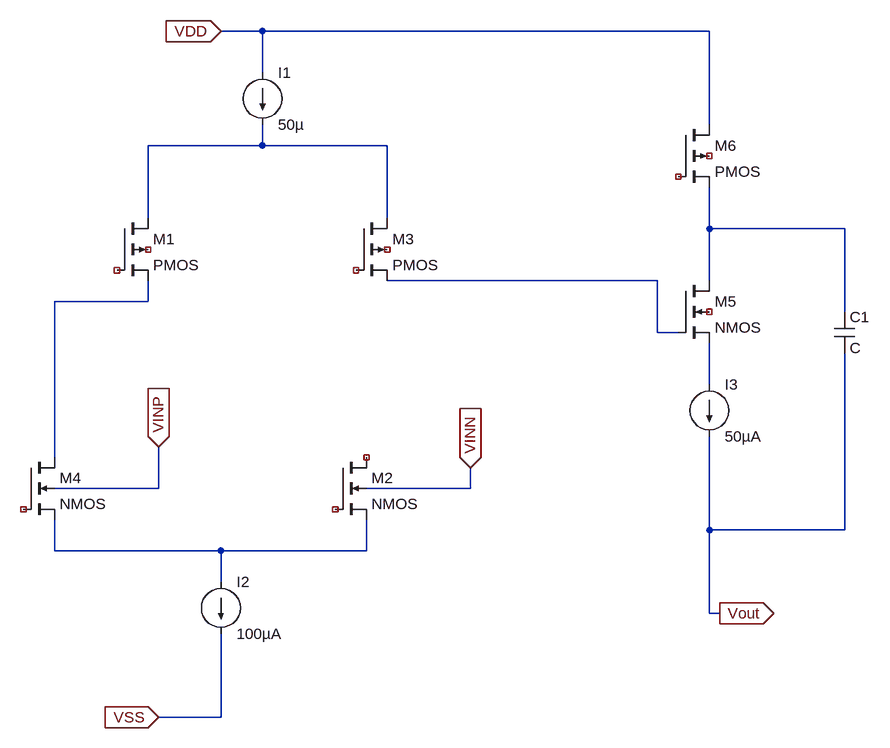
[diagram p0: schematic opamp.asc]
opamp.asc, the LTspice schematic file:
Version 4.1
SHEET 1 1400 1000
WIRE 368 -128 304 -128
WIRE 1056 -128 368 -128
WIRE 368 -64 368 -128
WIRE 1056 16 1056 -128
WIRE 368 48 368 16
WIRE 368 48 192 48
WIRE 560 48 368 48
WIRE 192 160 192 48
WIRE 560 160 560 48
WIRE 1056 176 1056 112
WIRE 1264 176 1056 176
WIRE 976 256 560 256
WIRE 1056 256 1056 176
WIRE 192 288 192 256
WIRE 192 288 48 288
WIRE 1264 304 1264 176
WIRE 976 336 976 256
WIRE 1008 336 976 336
WIRE 1056 416 1056 352
WIRE 48 528 48 288
WIRE 208 576 208 512
WIRE 208 576 48 576
WIRE 688 576 688 544
WIRE 688 576 528 576
WIRE 1056 640 1056 496
WIRE 1264 640 1264 368
WIRE 1264 640 1056 640
WIRE 48 672 48 624
WIRE 304 672 48 672
WIRE 528 672 528 624
WIRE 528 672 304 672
WIRE 304 720 304 672
WIRE 1056 768 1056 640
WIRE 1072 768 1056 768
WIRE 304 928 304 800
WIRE 304 928 208 928
FLAG 304 -128 VDD
IOPIN 304 -128 In
FLAG 688 544 VINN
IOPIN 688 544 In
FLAG 208 512 VINP
IOPIN 208 512 In
FLAG 208 928 VSS
IOPIN 208 928 In
FLAG 1072 768 Vout
IOPIN 1072 768 Out
SYMBOL pmos4 144 160 R0
SYMATTR InstName M1
SYMBOL pmos4 512 160 R0
SYMATTR InstName M3
SYMBOL nmos4 0 528 R0
SYMATTR InstName M4
SYMBOL current 368 -64 R0
WINDOW 123 0 0 Left 0
WINDOW 39 0 0 Left 0
SYMATTR InstName I1
SYMATTR Value 50µ
SYMBOL nmos4 480 528 R0
SYMATTR InstName M2
SYMBOL current 304 720 R0
WINDOW 123 0 0 Left 0
WINDOW 39 0 0 Left 0
SYMATTR InstName I2
SYMATTR Value 100µA
SYMBOL nmos4 1008 256 R0
SYMATTR InstName M5
SYMBOL pmos4 1008 16 R0
SYMATTR InstName M6
SYMBOL current 1056 416 R0
WINDOW 123 0 0 Left 0
WINDOW 39 0 0 Left 0
SYMATTR InstName I3
SYMATTR Value 50µA
SYMBOL cap 1248 304 R0
SYMATTR InstName C1

The netlist it stands for:
* opamp.asc
M1 N001 NC_01 N004 NC_02 PMOS
M3 N001 NC_03 N003 NC_04 PMOS
M4 N004 NC_05 N006 VINP NMOS
I1 VDD N001 50µ
M2 NC_06 NC_07 N006 VINN NMOS
I2 N006 VSS 100µA
M5 N002 N003 N005 NC_08 NMOS
M6 VDD NC_09 N002 NC_10 PMOS
I3 N005 Vout 50µA
C1 N002 Vout C
.model NMOS NMOS
.model PMOS PMOS
.lib standard.mos
.backanno
.end